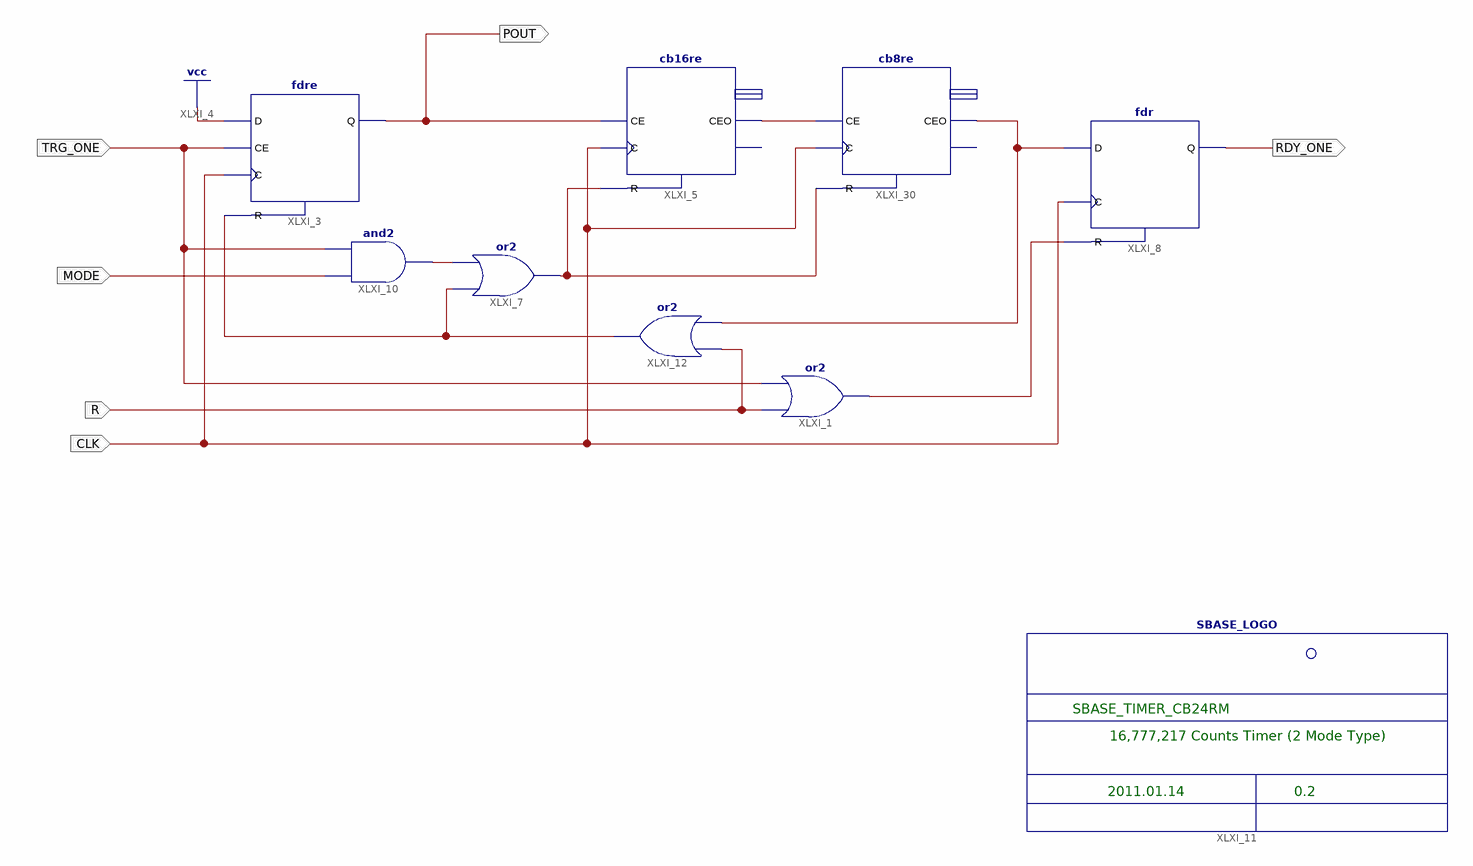
[diagram p0: schematic sheet 1]
// Xilinx ISE schematic SBASE_TIMER_CB24RM.sch (spartan3a) as structural Verilog: 9 symbols, 6 ports
module SBASE_TIMER_CB24RM (
  input  TRG_ONE,
  input  MODE,
  input  CLK,
  input  R,
  output POUT,
  output RDY_ONE
);

  wire XLXN_3, XLXN_5, XLXN_8, XLXN_12, XLXN_73, XLXN_76;

  SBASE_LOGO XLXI_11 ();
  or XLXI_1 (XLXN_3, R, TRG_ONE);
  fdre XLXI_3 (.C(CLK), .CE(TRG_ONE), .D(1'b1), .R(XLXN_12), .Q(POUT));
  cb16re XLXI_5 (.C(CLK), .CE(POUT), .R(XLXN_5), .CEO(XLXN_73));  // open: Q, TC
  and XLXI_10 (XLXN_8, MODE, TRG_ONE);
  or XLXI_7 (XLXN_5, XLXN_12, XLXN_8);
  or XLXI_12 (XLXN_12, R, XLXN_76);
  fdr XLXI_8 (.C(CLK), .D(XLXN_76), .R(XLXN_3), .Q(RDY_ONE));
  cb8re XLXI_30 (.C(CLK), .CE(XLXN_73), .R(XLXN_5), .CEO(XLXN_76));  // open: Q, TC

  // Notes on the sheet:
  //   SBASE_TIMER_CB24RM
  //   16,777,217 Counts Timer (2 Mode Type)
  //   2011.01.14
  //   0.2
endmodule
